# Altium schematic sheet aig2_power_cpu.SchDoc
size A0; PageSetup: Record=PageOptionsZCenterHorizontal=TrueZCenterVertical=TrueZPrintScale=2.00ZXCorrection=1.00ZYCorrection=1.00ZPrintKind=2ZBorderSize=5000000ZLeftOffset=0ZBottomOffset=0ZOrientation=2ZPaperLength=1000ZPaperWidth=1000ZScale=100ZPaperSource=7ZPrintQuality=-4ZMediaType=1ZDitherType=10ZPaperKind=A4ZPrintScaleMode=1
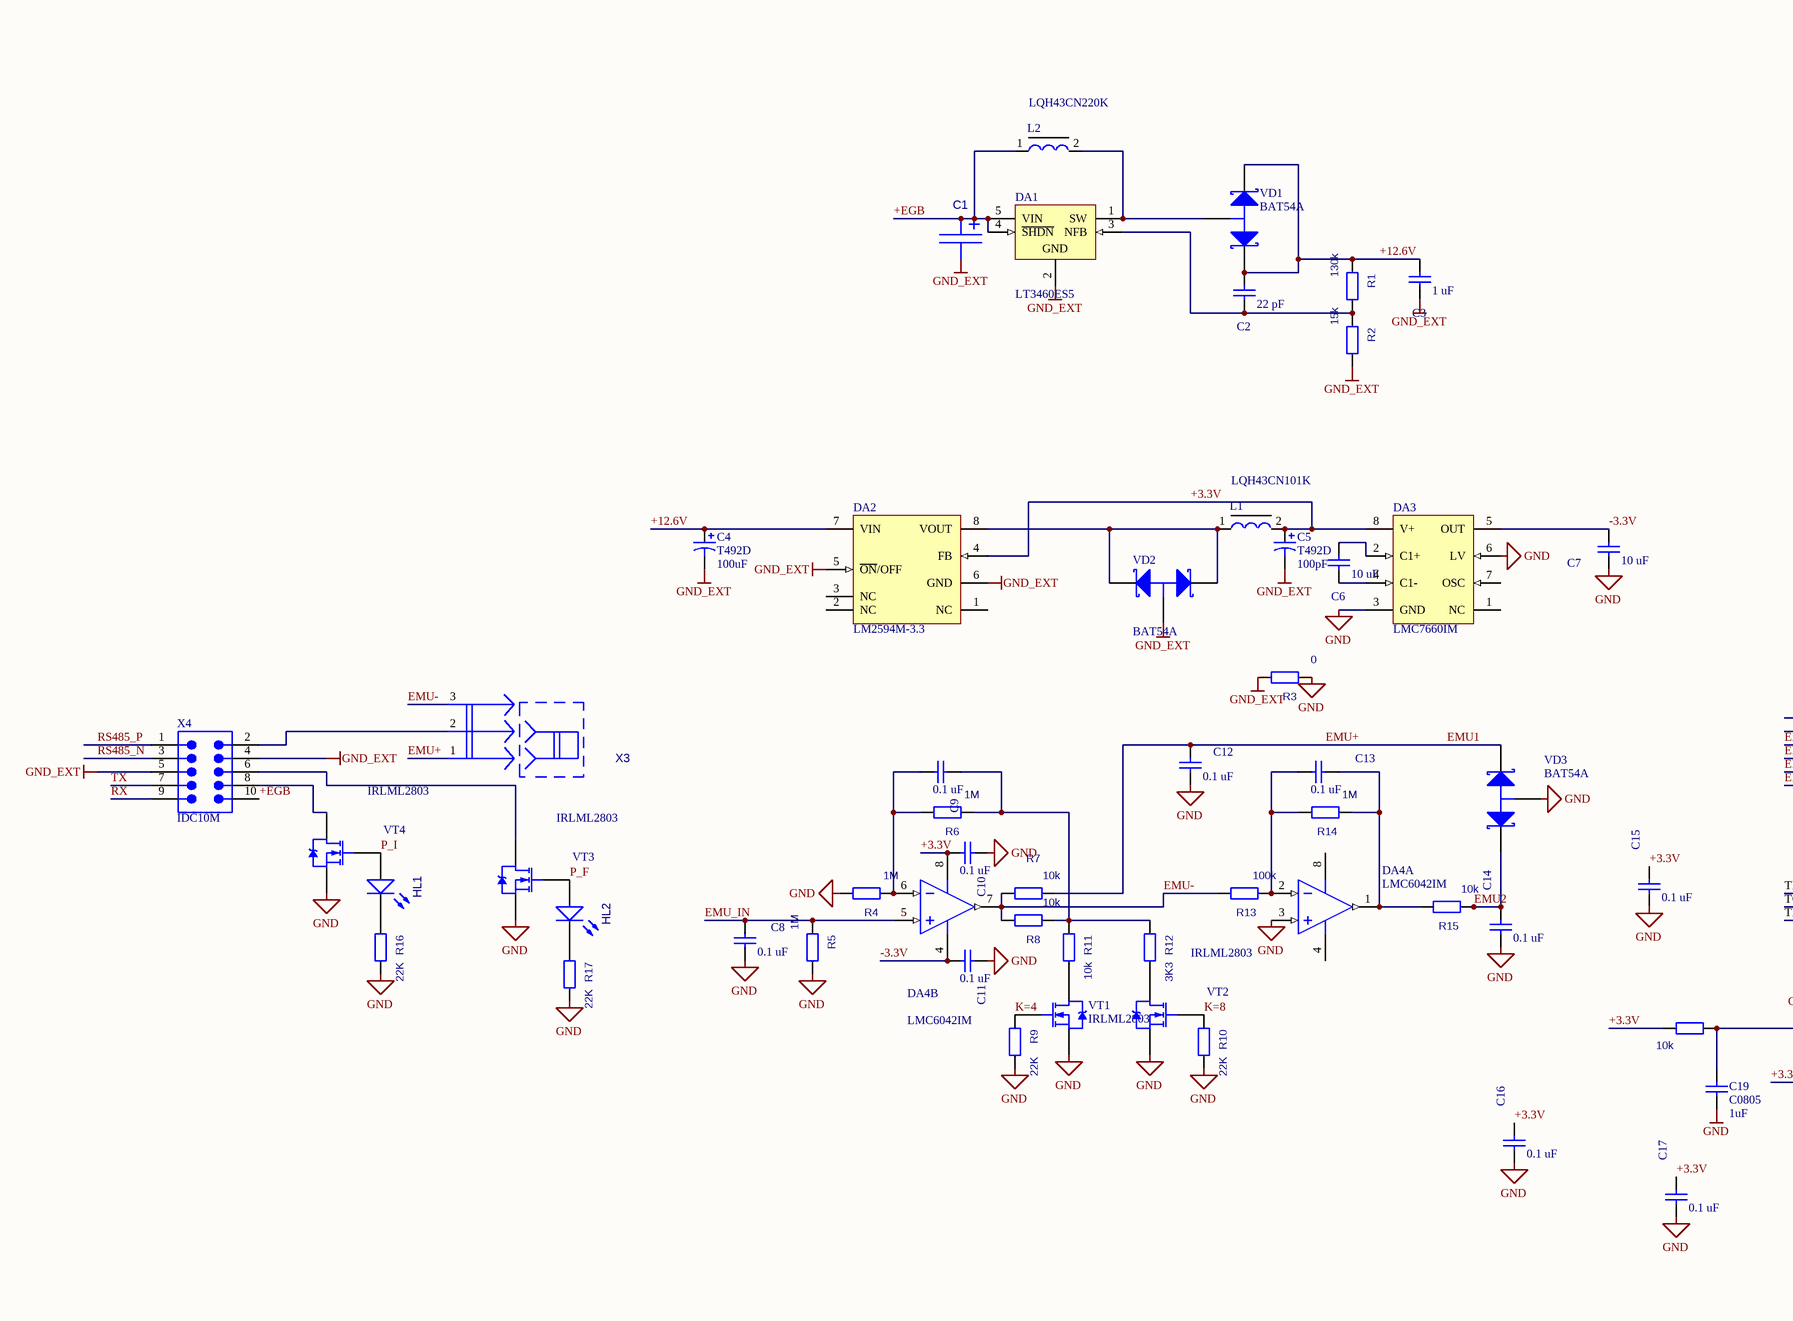
[diagram p0: aig2_power_cpu.SchDoc, left]
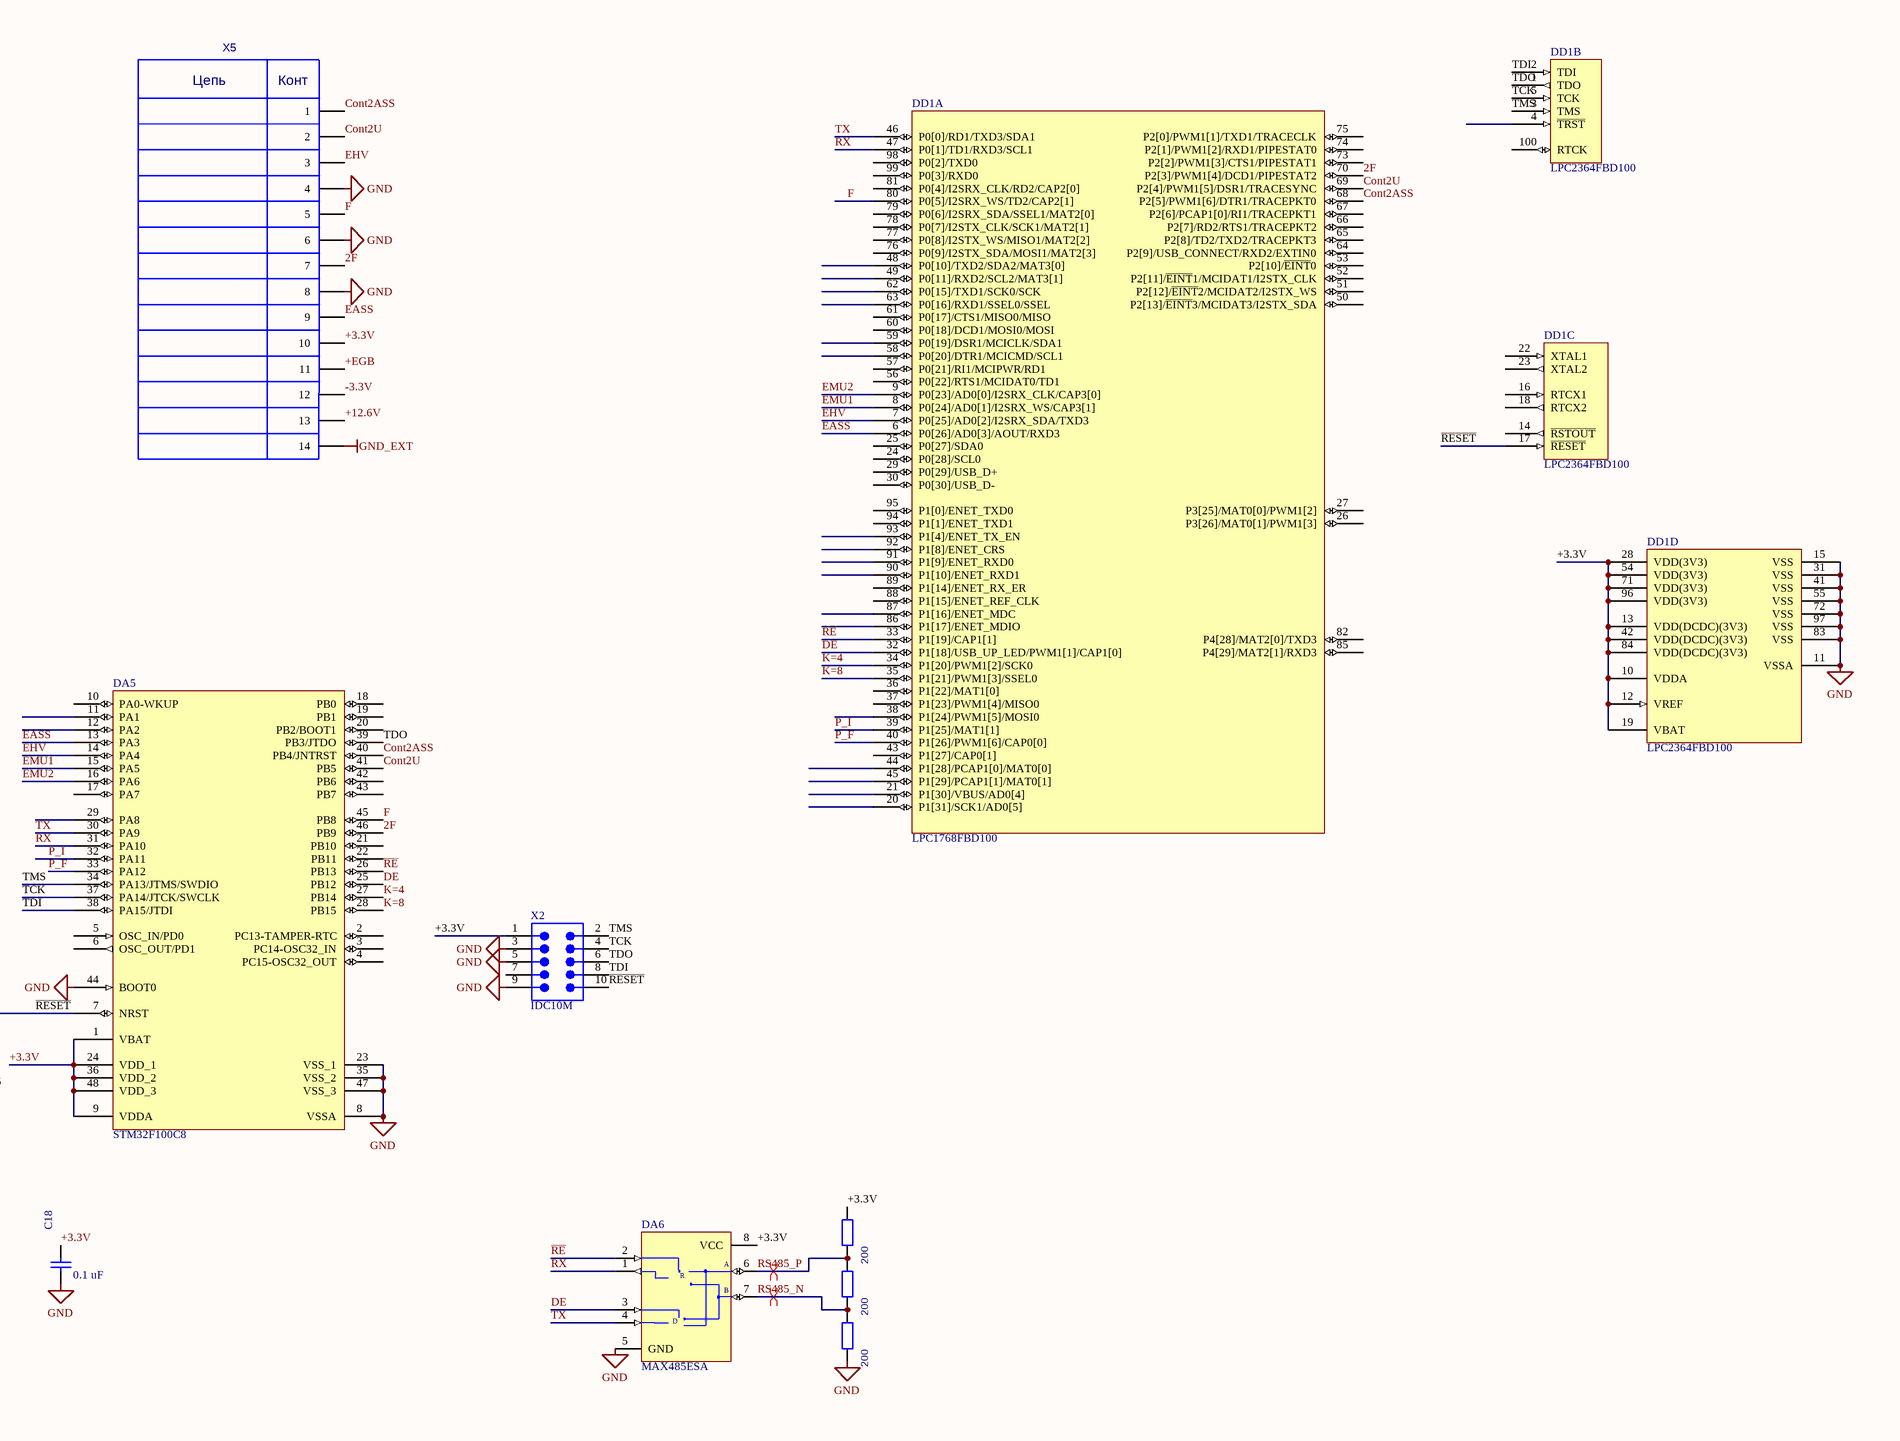
[diagram p1: aig2_power_cpu.SchDoc, right]

## Parts
C1  CAPASITOR A  [CAPASITOR A]  (value not drawn)
C2  value 22 pF  [CC0805]  (hidden comment: C0805)
C3  value 1 uF  [CC0805]  (hidden comment: C0805)
C4  T492D  value 100uF  [D]
C5  T492D  value 100pF  [D]
C6  value 10 uF  [CC0805]  (hidden comment: C0805)
C7  value 10 uF  [CC0805]  (hidden comment: C0805)
C8  value 0.1 uF  [CC0805]  (hidden comment: C0805)
C9  value 0.1 uF  [CC0805]  (hidden comment: C0805)
C10  value 0.1 uF  [CC0805]  (hidden comment: C0805)
C11  value 0.1 uF  [CC0805]  (hidden comment: C0805)
C12  value 0.1 uF  [CC0805]  (hidden comment: C0805)
C13  value 0.1 uF  [CC0805]  (hidden comment: C0805)
C14  value 0.1 uF  [CC0805]  (hidden comment: C0805)
C15  value 0.1 uF  [CC0805]  (hidden comment: C0805)
C16  value 0.1 uF  [CC0805]  (hidden comment: C0805)
C17  value 0.1 uF  [CC0805]  (hidden comment: C0805)
C18  value 0.1 uF  [CC0805]  (hidden comment: C0805)
C19  C0805  value 1uF  [CC0805]
DA1  LT3460ES5  [S5-T_N]
DA2  LM2594M-3.3  [M08A_N]
DA3  LMC7660IM  [M08A_N]
DA4  LMC6042IM  [M08A_N]  (parts A,B of 2)
DA5  STM32F100C8  [LQFP48_N]
DA6  MAX485ESA  [NSO8_N]
DD1  LPC1768FBD100  [SOT407-1_N]  (parts A,B,C,D of 4)
HL1  LED0805  [led1206]  (value not drawn)
HL2  LED0805  [led1206]  (value not drawn)
L1  LQH43CN101K  [1812]
L2  LQH43CN220K  [1812]
R1  value 130k  [RR0805]
R2  value 15k  [RR0805]
R3  value 0  [RR0805]
R4  value 1M  [RR0805]
R5  value 1M  [RR0805]
R6  value 1M  [RR0805]
R7  value 10k  [RR0805]
R8  value 10k  [RR0805]
R9  value 22K  [RR0805]
R10  value 22K  [RR0805]
R11  value 10k  [RR0805]
R12  value 3K3  [RR0805]
R13  value 100k  [RR0805]
R14  value 1M  [RR0805]
R15  value 10k  [RR0805]
R16  value 22K  [RR0805]
R17  value 22K  [RR0805]
R18  value 10k  [RR0805]
R19  value 200  [RR0805]
R20  value 200  [RR0805]
R21  value 200  [RR0805]
VD1  BAT54A  [SOT23_N]
VD2  BAT54A  [SOT23_N]
VD3  BAT54A  [SOT23_N]
VT1  IRLML2803  [SOT-23]
VT2  IRLML2803  [SOT-23]
VT3  IRLML2803  [SOT-23]
VT4  IRLML2803  [SOT-23]
X2  IDC10M  [idc10_2]
X3  JP3  [PLS-3 2.54]  (value not drawn)
X4  IDC10M  [idc10_2]
X5  IDC14M  [IDC14M]  (value not drawn)

## Nets
GND: C7.2 C8.1 C10.2 C11.2 C12.1 C14.1 C15.1 C16.1 C17.1 C18.1 C19.1 DA3.3(GND) DA3.6(LV) DA4.3(INA+) DA5.8(VSSA) DA5.23(VSS_1) DA5.35(VSS_2) DA5.44(BOOT0) DA5.47(VSS_3) DA6.5(GND) DD1.11(VSSA) DD1.15(VSS) DD1.31(VSS) DD1.41(VSS) DD1.55(VSS) DD1.72(VSS) DD1.83(VSS) DD1.97(VSS) R3.1 R4.2 R5.2 R9.2 R10.2 R16.2 R17.2 R21.1 VD3.3(A) VT1.2(S) VT2.2(S) VT3.2(S) VT4.2(S) X2.3 X2.5 X2.9 X5.4 X5.6 X5.8
GND_EXT: C1.2(i/o1) C3.2 C4.2 C5.2 DA1.2(GND) DA2.5(~{ON}/OFF) DA2.6(GND) R2.2 R3.2 VD2.3(A) X4.4 X4.5 X5.14
2F: DA5.46(PB9) DD1.70(P2[3]/PWM1[4]/DCD1/PIPESTAT2) X5.7
+3.3V: C5.1 C10.1 C15.2 C16.2 C17.2 C18.2 DA2.4(FB) DA3.8(V+) DA4.8(V+) DA5.1(VBAT) DA5.9(VDDA) DA5.24(VDD_1) DA5.36(VDD_2) DA5.48(VDD_3) DA6.8(VCC) DD1.10(VDDA) DD1.12(VREF) DD1.13(VDD(DCDC)(3V3)) DD1.19(VBAT) DD1.28(VDD(3V3)) DD1.42(VDD(DCDC)(3V3)) DD1.54(VDD(3V3)) DD1.71(VDD(3V3)) DD1.84(VDD(DCDC)(3V3)) DD1.96(VDD(3V3)) L1.2 R18.1 R19.2 X2.1 X5.10
+12.6V: C2.1 C3.1 C4.1 DA2.7(VIN) R1.1 VD1.1(K1) VD1.2(K2) X5.13
+EGB: C1.1(i/o) DA1.4(~{SHDN}) DA1.5(VIN) L2.1 X4.10 X5.11
-3.3V: C7.1 C11.1 DA3.5(OUT) DA4.4(V-) X5.12
Cont2ASS: DA5.40(PB4/JNTRST) DD1.68(P2[5]/PWM1[6]/DTR1/TRACEPKT0) X5.1
Cont2U: DA5.41(PB5) DD1.69(P2[4]/PWM1[5]/DSR1/TRACESYNC) X5.2
DE: DA5.25(PB12) DA6.3(DE) DD1.32(P1[18]/USB_UP_LED/PWM1[1]/CAP1[0])
EASS: DA5.13(PA3) DD1.6(P0[26]/AD0[3]/AOUT/RXD3) X5.9
EHV: DA5.14(PA4) DD1.7(P0[25]/AD0[2]/I2SRX_SDA/TXD3) X5.3
EMU2: C14.2 DA5.16(PA6) DD1.9(P0[23]/AD0[0]/I2SRX_CLK/CAP3[0]) R15.1 VD3.2(K2)
EMU+: C12.2 DA5.15(PA5) DD1.8(P0[24]/AD0[1]/I2SRX_WS/CAP3[1]) R7.1 VD3.1(K1) X3.1(I/O1)  [also labelled EMU1]
EMU-: DA4.7(OUTB) R7.2 R8.2 R13.2 X3.3(I/O3)
EMU_IN: C8.2 DA4.5(INB+) R5.1
F: DA5.45(PB8) DD1.80(P0[5]/I2SRX_WS/TD2/CAP2[1]) X5.5
K=4: DA5.27(PB14) DD1.34(P1[20]/PWM1[2]/SCK0) R9.1 VT1.1(G)
K=8: DA5.28(PB15) DD1.35(P1[21]/PWM1[3]/SSEL0) R10.1 VT2.1(G)
P_F: DA5.33(PA12) DD1.40(P1[26]/PWM1[6]/CAP0[0]) HL2.1(A) VT3.1(G)
P_I: DA5.32(PA11) DD1.39(P1[25]/MAT1[1]) HL1.1(A) VT4.1(G)
~{RE}: DA5.26(PB13) DA6.2(~{RE}) DD1.33(P1[19]/CAP1[1])
~{RESET}: C19.2 DA5.7(NRST) DD1.17(~{RESET}) R18.2 X2.10
RS485_N: DA6.7(B) R20.1 R21.2 X4.3
RS485_P: DA6.6(A) R19.1 R20.2 X4.1
RX: DA5.31(PA10) DA6.1(RO) DD1.47(P0[1]/TD1/RXD3/SCL1) X4.9
TCK: DA5.37(PA14/JTCK/SWCLK) DD1.5(TCK) X2.4
TDI: DA5.38(PA15/JTDI) DD1.2(TDI) X2.8
TDO: DA5.39(PB3/JTDO) DD1.1(TDO) X2.6
TMS: DA5.34(PA13/JTMS/SWDIO) DD1.3(TMS) X2.2
TX: DA5.30(PA9) DA6.4(DI) DD1.46(P0[0]/RD1/TXD3/SDA1) X4.7
NetC2_2: C2.2 DA1.3(NFB) R1.2 R2.1
NetC6_1: C6.1 DA3.2(C1+)
NetC6_2: C6.2 DA3.4(C1-)
NetC9_1: C9.1 DA4.6(INB-) R4.1 R6.2
NetC9_2: C9.2 R6.1 R8.1 R11.1 R12.1
NetC13_1: C13.1 DA4.2(INA-) R13.1 R14.2
NetC13_2: C13.2 DA4.1(OUTA) R14.1 R15.2
NetDA1_1: DA1.1(SW) L2.2 VD1.3(A)
NetDA2_8: DA2.8(VOUT) L1.1 VD2.1(K1) VD2.2(K2)
NetHL1_2: HL1.2(K) R16.1
NetHL2_2: HL2.2(K) R17.1
NetR11_2: R11.2 VT1.3(D)
NetR12_2: R12.2 VT2.3(D)
NetVT3_3: VT3.3(D) X4.6
NetVT4_3: VT4.3(D) X4.8
NetX3_2: X3.2(I/O2) X4.2

Not connected (* = marked no-connect by the designer): DA2 1(NC) 2(NC) 3(NC); DA3 1(NC) 7(OSC); DA5 2(PC13-TAMPER-RTC) 3(PC14-OSC32_IN) 4(PC15-OSC32_OUT) 5(OSC_IN/PD0) 6(OSC_OUT/PD1) 10(PA0-WKUP) 11(PA1) 12(PA2) 17(PA7) 18(PB0) 19(PB1) 20(PB2/BOOT1) 21(PB10) 22(PB11) 29(PA8) 42(PB6) 43(PB7); DD1 4(~{TRST}) 14(~{RSTOUT}) 16(RTCX1) 18(RTCX2) 20(P1[31]/SCK1/AD0[5]) 21(P1[30]/VBUS/AD0[4]) 22(XTAL1) 23(XTAL2) 24(P0[28]/SCL0) 25(P0[27]/SDA0) 26(P3[26]/MAT0[1]/PWM1[3]) 27(P3[25]/MAT0[0]/PWM1[2]) 29(P0[29]/USB_D+) 30(P0[30]/USB_D-) 36(P1[22]/MAT1[0]) 37(P1[23]/PWM1[4]/MISO0) 38(P1[24]/PWM1[5]/MOSI0) 43(P1[27]/CAP0[1]) 44(P1[28]/PCAP1[0]/MAT0[0]) 45(P1[29]/PCAP1[1]/MAT0[1]) 48(P0[10]/TXD2/SDA2/MAT3[0]) 49(P0[11]/RXD2/SCL2/MAT3[1]) 50(P2[13]/~{EINT}3/MCIDAT3/I2STX_SDA) 51(P2[12]/~{EINT}2/MCIDAT2/I2STX_WS) 52(P2[11]/~{EINT}1/MCIDAT1/I2STX_CLK) 53(P2[10]/~{EINT}0) 56(P0[22]/RTS1/MCIDAT0/TD1) 57(P0[21]/RI1/MCIPWR/RD1) 58(P0[20]/DTR1/MCICMD/SCL1) 59(P0[19]/DSR1/MCICLK/SDA1) 60(P0[18]/DCD1/MOSI0/MOSI) 61(P0[17]/CTS1/MISO0/MISO) 62(P0[15]/TXD1/SCK0/SCK) 63(P0[16]/RXD1/SSEL0/SSEL) 64(P2[9]/USB_CONNECT/RXD2/EXTIN0) 65(P2[8]/TD2/TXD2/TRACEPKT3) 66(P2[7]/RD2/RTS1/TRACEPKT2) 67(P2[6]/PCAP1[0]/RI1/TRACEPKT1) 73(P2[2]/PWM1[3]/CTS1/PIPESTAT1) 74(P2[1]/PWM1[2]/RXD1/PIPESTAT0) 75(P2[0]/PWM1[1]/TXD1/TRACECLK) 76(P0[9]/I2STX_SDA/MOSI1/MAT2[3]) 77(P0[8]/I2STX_WS/MISO1/MAT2[2]) 78(P0[7]/I2STX_CLK/SCK1/MAT2[1]) 79(P0[6]/I2SRX_SDA/SSEL1/MAT2[0]) 81(P0[4]/I2SRX_CLK/RD2/CAP2[0]) 82(P4[28]/MAT2[0]/TXD3) 85(P4[29]/MAT2[1]/RXD3) 86(P1[17]/ENET_MDIO) 87(P1[16]/ENET_MDC) 88(P1[15]/ENET_REF_CLK) 89(P1[14]/ENET_RX_ER) 90(P1[10]/ENET_RXD1) 91(P1[9]/ENET_RXD0) 92(P1[8]/ENET_CRS) 93(P1[4]/ENET_TX_EN) 94(P1[1]/ENET_TXD1) 95(P1[0]/ENET_TXD0) 98(P0[2]/TXD0) 99(P0[3]/RXD0) 100(RTCK); X2 7

## Layout directives
differential pair: RS485_N, RS485_P

## Notes on the sheet
- (in symbol IDC14M) Цепь; Конт
- (in symbol MAX485ESA) R; D

## Library data of the parts
C2 C3 C6-C19 = C0805: Ceramic Chip Capacitor - Standard; Note: Footprint corresponds to dimensions for bulk cassette packaging. This case size has tightened tolerances.; Published: 17-Jul-2002; LatestRevisionDate: 19-Mar-2004; LatestRevisionNote: Silkscreen size reduced.; DatasheetDocument: Mar-2001; PackageDocument: Mar-2001; PackageReference: 0805; Publisher: Altium Limited; Code_JEITA: 0805; Code_IPC: 2012[0805]; ComponentLink1Description: Manufacturer Link; ComponentLink1URL: http://www.kemet.com/; ComponentLink2Description: Datasheet; ComponentLink2URL: http://www.kemet.com/kemet/web/homepage/kechome.nsf/vapubfilesname/F3102TA.pdf/$file/F3102TA.pdf
C4 C5 = T492D: Solid Tantalum Chip Capacitor, T492 Series - CWR11 Style Per Mil-PRF-55365/8; Published: 17-Jul-2002; LatestRevisionDate: 19-Mar-2004; LatestRevisionNote: Silkscreen dimensions re-sized.; DatasheetDocument: Mar-2001; PackageDocument: Mar-2001; PackageReference: D; Publisher: Altium Limited; Code_JEITA: 7343-31; ComponentLink1Description: Manufacturer Link; ComponentLink1URL: http://www.kemet.com/; ComponentLink2Description: Datasheet; ComponentLink2URL: http://www.kemet.com/kemet/web/homepage/kechome.nsf/vapubfilesname/F3102TA.pdf/$file/F3102TA.pdf
DA1 = LT1931AES5: 2.2MHz Inverting Current Mode DC/DC Converter; Note: 1639; Published: 6-Jun-2005; LatestRevisionDate: 29-May-2009; LatestRevisionNote: IPC-7351 Footprint Added.; DatasheetVersion: Jun-2001; PackageVersion: 2005; PackageReference: S5-T; Publisher: Altium Limited; PackageDescription: 5-Pin SOT-23 Package 0.95 mm Pitch, 2.8 mm Lead Span; Code_IPC: SOT23-5; ComponentLink1Description: Manufacturer Link; ComponentLink1URL: http://www.linear.com/; ComponentLink2Description: Datasheet; ComponentLink2URL: http://www.linear.com/pc/downloadDocument.do?navId=H0,C1,C1003,C1042,P1863,D3921
DA2 = LM2594M-3.3: SIMPLE SWITCHER Power Converter 150 KHz 0.5A Step-Down Voltage Regulator; Manufacturer: National Semiconductor; PackageTopMarking: NSZXTT*2594*M-3.3; PowerWise: N; FirstPublished: 4-Dec-2008; DatasheetVersion: Dec-1999; PackageVersion: revL, Sep-2006; PackageReference: M08A; Publisher: Altium Limited; PackageDescription: SOIC Narrow, 4.9 x 3.9 x 1.45mm, 8 Lead, 1.27mm Pitch; CompType: Switcher; PartNumber: LM2594M-3.3; RoHS: O; PinCount: 8; DigiKeyPartNumber: LM2594M-3.3-ND; Code_JEDEC: MS-012-AA; Code_IPC: SOIC127P600-8; ComponentLink1Description: LM2594 Datasheet; ComponentLink1URL: http://www.national.com/ds/LM/LM2594.pdf; ComponentLink2Description: LM2594 Web Page; ComponentLink2URL: http://www.national.com/pf/LM/LM2594.html; ComponentLink3Description: M08A Package Page; ComponentLink3URL: http://www.national.com/packaging/folders/m08a.html
DA3 = LMC7660IM: Switched Capacitor Voltage Converter; Manufacturer: National Semiconductor; CompType: Switch Caps; PackageTopMarking: NSZXTT*LMC76*60IM; PowerWise: N; Published: 4-Dec-2008; DatasheetVersion: Feb-2005; PackageVersion: revL, Sep-2006; PackageReference: M08A; Publisher: Altium Limited; PackageDescription: SOIC Narrow, 4.9 x 3.9 x 1.45mm, 8 Lead, 1.27mm Pitch; PartNumber: LMC7660IM; RoHS: O; PinCount: 8; DigiKeyPartNumber: LMC7660IM-ND; Code_JEDEC: MS-012-AA; Code_IPC: SOIC127P600-8; ComponentLink1Description: LMC7660 Datasheet; ComponentLink1URL: http://www.national.com/ds/LM/LMC7660.pdf; ComponentLink2Description: LMC7660 Web Page; ComponentLink2URL: http://www.national.com/pf/LM/LMC7660.html; ComponentLink3Description: M08A Package Page; ComponentLink3URL: http://www.national.com/packaging/folders/m08a.html
DA4 = LMC6042IM: CMOS Dual Micropower Operational Amplifier; Manufacturer: National Semiconductor; CompType: Amplifiers; PackageTopMarking: NSZXTT*LMC60*42IM; PowerWise: Y; Published: 4-Dec-2008; LatestRevisionDate: 13-Jan-2009; LatestRevisionNote: Sim Model Added.; DatasheetVersion: Aug-2000; PackageVersion: revL, Sep-2006; PackageReference: M08A; Publisher: Altium Limited; PackageDescription: SOIC Narrow, 4.9 x 3.9 x 1.45mm, 8 Lead, 1.27mm Pitch; PartNumber: LMC6042IM; RoHS: O; PinCount: 8; DigiKeyPartNumber: LMC6042IM-ND; Code_JEDEC: MS-012-AA; Code_IPC: SOIC127P600-8; ComponentLink1Description: LMC6042 Datasheet; ComponentLink1URL: http://www.national.com/ds/LM/LMC6042.pdf; ComponentLink2Description: LMC6042 Web Page; ComponentLink2URL: http://www.national.com/pf/LM/LMC6042.html; ComponentLink3Description: M08A Package Page; ComponentLink3URL: http://www.national.com/packaging/folders/m08a.html
DA5 = STM32F101C6T6: STM32 ARM-based 32-bit MCU with 32 Kbytes Flash, 48-pin LQFP, Industrial Temperature; Published: 30-May-2008; DatasheetVersion: rev6, Mar-2008; PackageVersion: Mar-2008; PackageReference: LQFP48; Publisher: Altium Limited; PackageDescription: 48-Pin Low-Profile Quad Flat Pack, 7 x 7 mm Body, 0.5 mm Pitch (LQFP48); ComponentLink1Description: Manufacturer Link; ComponentLink1URL: www.st.com/stm32; ComponentLink2Description: Datasheet; ComponentLink2URL: http://www.st.com/stonline/products/literature/ds/13586.pdf
DA6 = MAX485ESA: Low-Power, Slew-Rate-Limited RS-485/RS-422 Transceiver; Published: 16-Jan-2001; LatestRevisionDate: 13-Apr-2006; LatestRevisionNote: IPC-7351 Footprint Added.; DatasheetVersion: Feb-1996; PackageReference: NSO8; Publisher: Altium Limited; PackageDescription: 8-Pin Small Outline Integrated Circuit 1.27 mm Pitch; Code_JEDEC: MS-012-AA; Code_IPC: SOIC127P600-8; ComponentLink1Description: Manufacturer Link; ComponentLink1URL: http://www.maxim-ic.com/; ComponentLink2Description: Datasheet; ComponentLink2URL: http://pdfserv.maxim-ic.com/en/ds/MAX1487-MAX491.pdf
DD1 = LPC2364FBD100: ARM7 16/32-Bit Microcontroller, 128KB Flash, 34KB RAM, 4 Channel CAN, 100-Lead LQFP; Code_IEC: 136E20; Published: 17-Aug-2007; DatasheetVersion: rev.01, Jan-2007; PackageVersion: Feb-2003; PackageReference: SOT407-1; Publisher: Altium Limited; PackageDescription: 100-Pin Plastic Low Profile Quad Flat Pack, LQFP100; Code_JEDEC: MS-026; ComponentLink1Description: Manufacturer Link; ComponentLink1URL: http://www.nxp.com/; ComponentLink2Description: Datasheet; ComponentLink2URL: http://www.standardics.nxp.com/products/lpc2000/datasheet/lpc2364.lpc2366.lpc2368.pdf
HL1 HL2 = LED0805: OriginalName: LED0; Value: {Value}
L1 L2 = CDRH127: Дроссель
R1-R21 = R_0805: Price: {Price}
VD1-VD3 = BAT54A: Schottky Barrier Double Diode; Published: 17-Sep-2003; LatestRevisionDate: 12-Dec-2006; LatestRevisionNote: IPC-7351 Footprint Added.; DatasheetVersion: 4-Mar-2002; PackageVersion: May-1999; PackageReference: SOT23; Publisher: Altium Limited; PackageDescription: 3-Pin SOT-23 Package 0.95 mm Pitch, 2.3 mm Lead Span; ComponentLink1Description: Manufacturer Link; ComponentLink1URL: http://www.semiconductors.philips.com/; ComponentLink2Description: Datasheet; ComponentLink2URL: http://www.semiconductors.philips.com/acrobat/datasheets/BAT54_SERIES_4.pdf
VT1-VT4 = IRLML2803: HEXFET Power MOSFET; Published: 8-Jun-2000; LatestRevisionDate: 17-Jul-2002; LatestRevisionNote: Re-released for DXP Platform.; DatasheetVersion: Aug-1997; PackageReference: SOT-23; Publisher: Altium Limited; PackageDescription: SOT-23; 3 Leads; Body 3.1 x 2.5 mm, inc. leads (LxW max); ComponentLink1Description: Manufacturer Link; ComponentLink1URL: http://www.irf.com/; ComponentLink2Description: Datasheet; ComponentLink2URL: http://www.irf.com/product-info/datasheets/data/irlml2803.pdf
X2 X4 = 09 18 110 9621: Flat Cable Connector (IDC), PCB Transition Connector, 2 Rows, Solder Pin, 10 Contacts; PCB_Layout: Complies with manufacturer's recommendation.; DrillSize: Corresponds to nominal value.; Published: 15-Nov-2004; DatasheetDocument: Sep-2003; PackageDocument: 26-Nov-2003; PackageReference: 9181109621; Publisher: Altium Limited; ComponentLink1Description: Manufacturer Link; ComponentLink1URL: http://www.harting.com/; ComponentLink2Description: Selection Guide; ComponentLink2URL: http://www.harting.com/imperia/md/content/steckverbinderundsystemkomponenten/folder/interface_engl_chapter_09.pdf
C1 = CAPASITOR A: Value: *
X3 = JP3: Value: *
X5 = IDC14M: Value: *